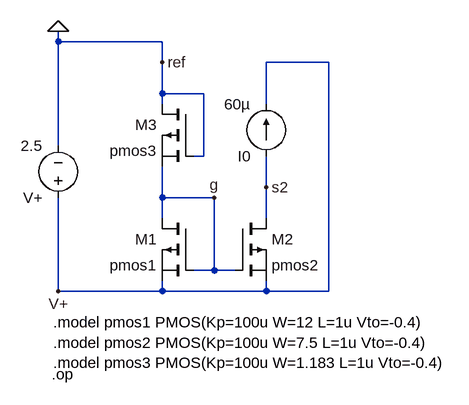
[diagram p0: schematic 14-10-8-a-1.asc]
14-10-8-a-1.asc, the LTspice schematic file:
Version 4
SHEET 1 880 680
WIRE -64 -64 -64 -80
WIRE 96 -64 -64 -64
WIRE 96 -32 96 -64
WIRE 352 -32 256 -32
WIRE 96 16 96 -32
WIRE 160 16 96 16
WIRE 96 32 96 16
WIRE 256 32 256 -32
WIRE -64 96 -64 -64
WIRE 160 112 160 16
WIRE 160 112 144 112
WIRE 256 160 256 112
WIRE 96 176 96 128
WIRE 176 176 96 176
WIRE 96 208 96 176
WIRE 256 208 256 160
WIRE 176 288 176 176
WIRE 176 288 144 288
WIRE 208 288 176 288
WIRE -64 320 -64 176
WIRE 96 320 96 304
WIRE 96 320 -64 320
WIRE 256 320 256 304
WIRE 256 320 96 320
WIRE 352 320 352 -32
WIRE 352 320 256 320
FLAG 96 -32 ref
FLAG 256 160 s2
FLAG 176 176 g
FLAG -64 -80 0
FLAG -64 320 V+
SYMBOL pmos 144 32 M0
SYMATTR InstName M3
SYMATTR Value pmos3
SYMBOL pmos 144 208 M0
SYMATTR InstName M1
SYMATTR Value pmos1
SYMBOL pmos 208 208 R0
SYMATTR InstName M2
SYMATTR Value pmos2
SYMBOL voltage -64 192 R180
WINDOW 123 0 0 Left 0
WINDOW 39 0 0 Left 0
SYMATTR InstName V+
SYMATTR Value 2.5
SYMBOL current 256 112 R180
WINDOW 123 0 0 Left 0
WINDOW 39 0 0 Left 0
SYMATTR InstName I0
SYMATTR Value 60µ
TEXT -72 368 Left 2 !.model pmos1 PMOS(Kp=100u W=12 L=1u Vto=-0.4)\n.model pmos2 PMOS(Kp=100u W=7.5 L=1u Vto=-0.4)\n.model pmos3 PMOS(Kp=100u W=1.183 L=1u Vto=-0.4)
TEXT -74 448 Left 2 !.op

The netlist it stands for:
* 14-10-8-a-1.asc
M3 0 0 g g pmos3
M1 g g V+ V+ pmos1
M2 s2 g V+ V+ pmos2
V+ V+ 0 2.5
I0 s2 V+ 60µ
.model NMOS NMOS
.model PMOS PMOS
.lib standard.mos
.model pmos1 PMOS(Kp=100u W=12 L=1u Vto=-0.4)
.model pmos2 PMOS(Kp=100u W=7.5 L=1u Vto=-0.4)
.model pmos3 PMOS(Kp=100u W=1.183 L=1u Vto=-0.4)
.op
.backanno
.end